# Altium schematic sheet Connector-Section.SchDoc
size A4; DocumentNumber: 8; SheetNumber: 9; SheetTotal: 8
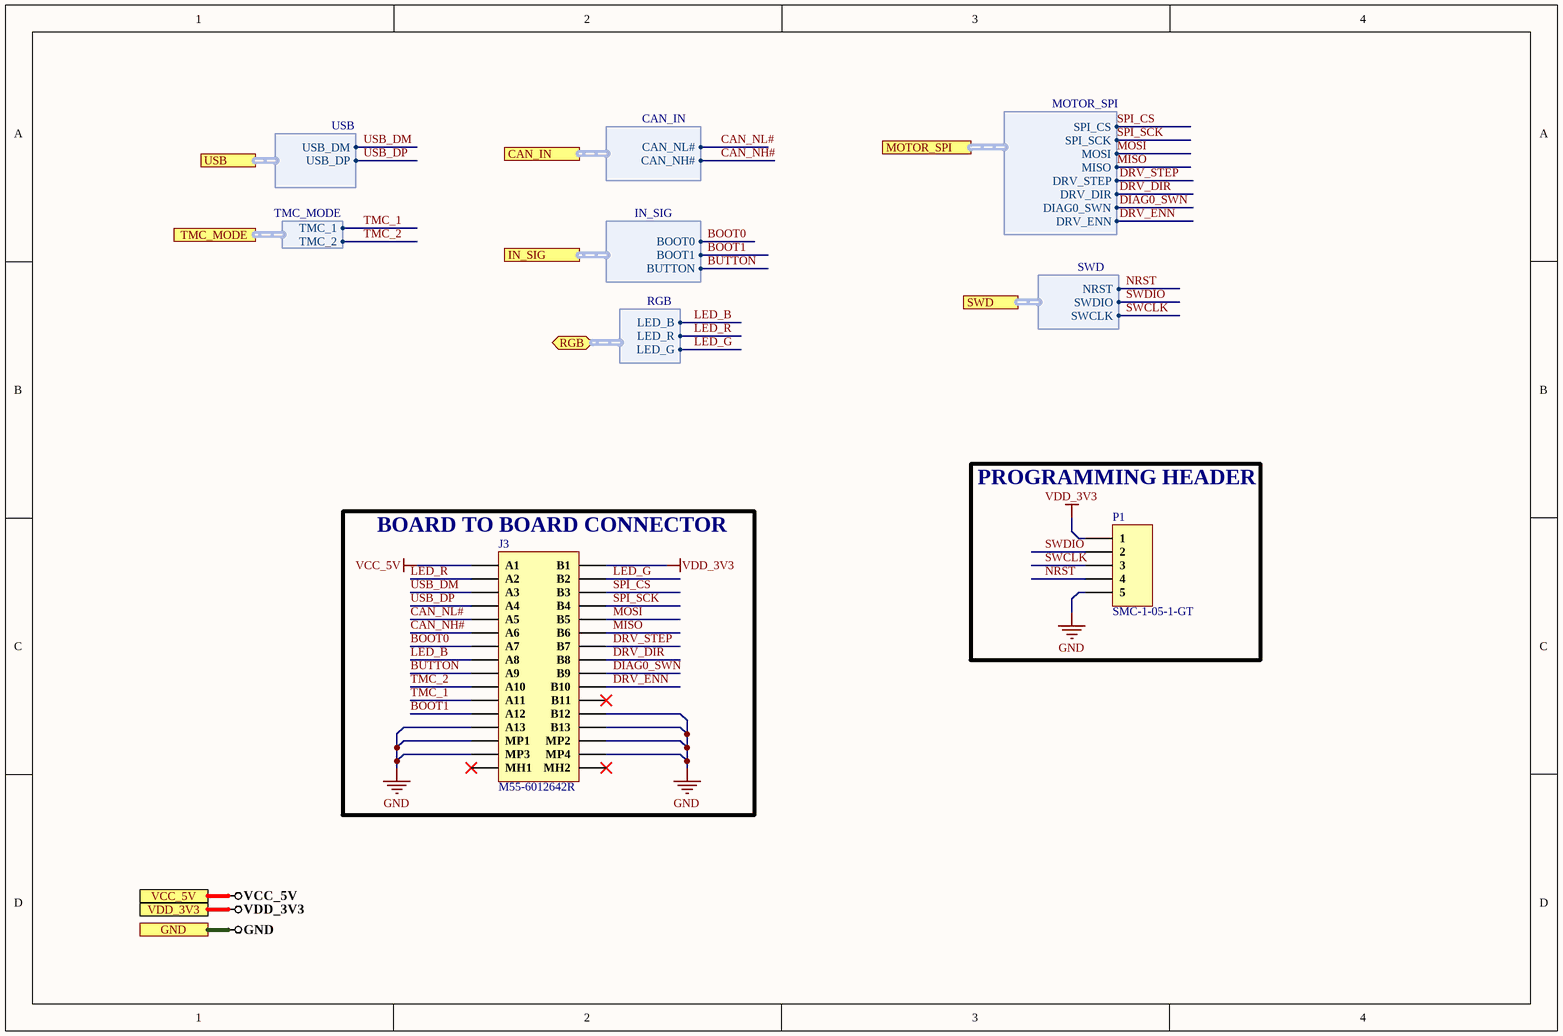
[diagram p0: Connector-Section.SchDoc]

## Parts
J3  M55-6012642R  [M55-6012642R]
P1  SMC-1-05-1-GT  [SMC-1-05-1-GT]

## Blocks framed on the sheet
BOARD TO BOARD CONNECTOR: J3
PROGRAMMING HEADER: P1

## Ports
CAN_IN (harness CAN_IN), GND, IN_SIG (harness IN_SIG), MOTOR_SPI (harness MOTOR_SPI), RGB (bidir, harness RGB), SWD (harness SWD), TMC_MODE (harness TMC_MODE), USB (harness USB), VCC_5V, VDD_3V3

## Harnesses
USB: USB_DM, USB_DP
CAN_IN: CAN_NL#, CAN_NH#
MOTOR_SPI: SPI_CS, SPI_SCK, MOSI, MISO, DRV_STEP, DRV_DIR, DRV_ENN, DIAG0_SWN
IN_SIG: BOOT0, BUTTON, BOOT1
SWD: NRST, SWDIO, SWCLK
TMC_MODE: TMC_1, TMC_2
RGB: LED_R, LED_G, LED_B

## Nets
GND: J3.A13 J3.B12 J3.B13 J3.MP1 J3.MP2 J3.MP3 J3.MP4 P1.5 ; port GND
VCC_5V: J3.A1 ; port VCC_5V
VDD_3V3: J3.B1 P1.1 ; port VDD_3V3
BOOT0: J3.A7 ; port IN_SIG.BOOT0
BOOT1: J3.A12 ; port IN_SIG.BOOT1
BUTTON: J3.A9 ; port IN_SIG.BUTTON
CAN_NH#: J3.A6 ; port CAN_IN.CAN_NH#
CAN_NL#: J3.A5 ; port CAN_IN.CAN_NL#
DIAG0_SWN: J3.B9 ; port MOTOR_SPI.DIAG0_SWN
DRV_DIR: J3.B8 ; port MOTOR_SPI.DRV_DIR
DRV_ENN: J3.B10 ; port MOTOR_SPI.DRV_ENN
DRV_STEP: J3.B7 ; port MOTOR_SPI.DRV_STEP
LED_B: J3.A8 ; port RGB.LED_B
LED_G: J3.B2 ; port RGB.LED_G
LED_R: J3.A2 ; port RGB.LED_R
MISO: J3.B6 ; port MOTOR_SPI.MISO
MOSI: J3.B5 ; port MOTOR_SPI.MOSI
NRST: P1.4 ; port SWD.NRST
SPI_CS: J3.B3 ; port MOTOR_SPI.SPI_CS
SPI_SCK: J3.B4 ; port MOTOR_SPI.SPI_SCK
SWCLK: P1.3 ; port SWD.SWCLK
SWDIO: P1.2 ; port SWD.SWDIO
TMC_1: J3.A11 ; port TMC_MODE.TMC_1
TMC_2: J3.A10 ; port TMC_MODE.TMC_2
USB_DM: J3.A3 ; port USB.USB_DM
USB_DP: J3.A4 ; port USB.USB_DP

Not connected (* = marked no-connect by the designer): J3 B11* MH1* MH2*

## Library data of the parts
J3 = M55-6012642R: CONN RCPT 26POS 0.05 GOLD SMD; Manufacturer: Harwin; Supplier 1: Digi-Key; Manufacturer Part Number: M55-6012642R; RoHS: Yes; Category: Connectors; Stock 1: 320; Pricing 1: 1=2.50000, 10=2.17600, 100=1.94480 (USD); RoHS Compliant: Yes; Supplier Part Number 1: 952-3846-1-ND
P1 = SMC-1-05-1-GT: MACHINE PIN SOCKET 5P 2.54MM PIT; Manufacturer: Adam Equipment; Supplier 1: Digi-Key; Manufacturer Part Number: SMC-1-05-1-GT; RoHS: No; Stock 1: 1697; Pricing 1: 1=0.41000, 10=0.38500, 25=0.33040, 50=0.28080, 100=0.26970, 250=0.24224, 500=0.23120, 1000=0.19268, 2500=0.17616 (USD); Supplier Part Number 1: 2057-SMC-1-05-1-GT-ND